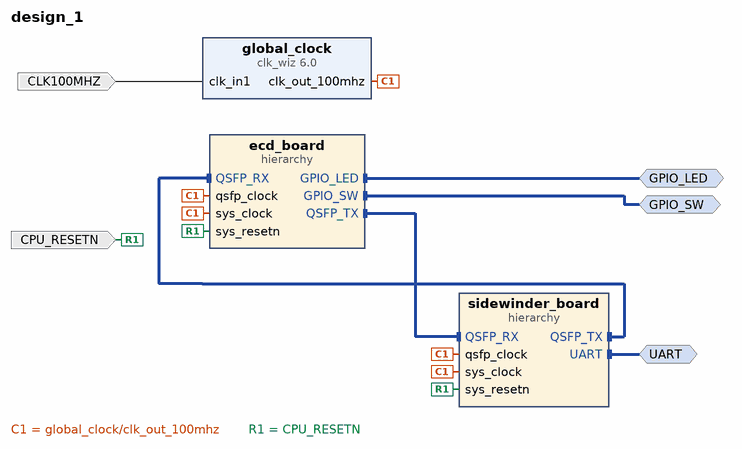
[diagram p0: block diagram of the top level]
# Vivado block design design_1, xc7a100tcsg324-1, Vivado 2021.1
create_bd_design design_1

create_bd_intf_port -mode Master -vlnv xilinx.com:interface:uart_rtl:1.0 UART
create_bd_intf_port -mode Master -vlnv xilinx.com:interface:gpio_rtl:1.0 GPIO_LED
create_bd_intf_port -mode Master -vlnv xilinx.com:interface:gpio_rtl:1.0 GPIO_SW
create_bd_port -dir I -type rst CPU_RESETN
create_bd_port -dir I -type clk CLK100MHZ
set_property -dict {CONFIG.ASSOCIATED_RESET CPU_RESETN} [get_bd_ports CLK100MHZ]

create_bd_cell -type hier sidewinder_board
create_bd_cell -type ip -vlnv xilinx.com:ip:clk_wiz:6.0 global_clock
set_property -dict [list \
  CONFIG.CLKOUT1_DRIVES BUFGCE \
  CONFIG.CLKOUT2_DRIVES BUFGCE \
  CONFIG.CLKOUT3_DRIVES BUFGCE \
  CONFIG.CLKOUT4_DRIVES BUFGCE \
  CONFIG.CLKOUT5_DRIVES BUFGCE \
  CONFIG.CLKOUT6_DRIVES BUFGCE \
  CONFIG.CLKOUT7_DRIVES BUFGCE \
  CONFIG.CLK_OUT1_PORT clk_out_100mhz \
  CONFIG.FEEDBACK_SOURCE FDBK_AUTO \
  CONFIG.USE_LOCKED false \
  CONFIG.USE_RESET false \
  CONFIG.USE_SAFE_CLOCK_STARTUP true \
] [get_bd_cells global_clock]
create_bd_cell -type hier ecd_board

# ---- hierarchy /sidewinder_board ----
current_bd_instance /sidewinder_board
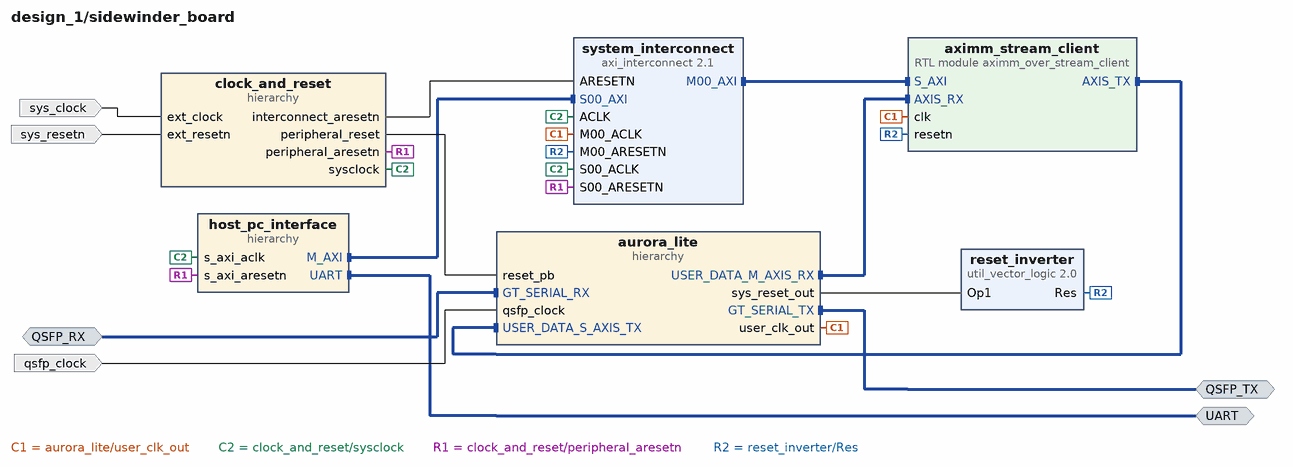
[diagram p1: block diagram inside /sidewinder_board]
create_bd_intf_pin -mode Master -vlnv xilinx.com:interface:uart_rtl:1.0 UART
create_bd_intf_pin -mode Slave -vlnv xilinx.com:interface:axis_rtl:1.0 QSFP_RX
create_bd_intf_pin -mode Master -vlnv xilinx.com:interface:axis_rtl:1.0 QSFP_TX
create_bd_pin -dir I -type rst sys_resetn
create_bd_pin -dir I -type clk sys_clock
create_bd_pin -dir I -type clk qsfp_clock

create_bd_cell -type hier clock_and_reset
create_bd_cell -type hier host_pc_interface
create_bd_cell -type hier aurora_lite
create_bd_cell -type ip -vlnv xilinx.com:ip:axi_interconnect:2.1 system_interconnect
set_property -dict {CONFIG.NUM_MI 1} [get_bd_cells system_interconnect]
create_bd_cell -type ip -vlnv xilinx.com:ip:util_vector_logic:2.0 reset_inverter
set_property -dict {CONFIG.C_OPERATION not CONFIG.C_SIZE 1} [get_bd_cells reset_inverter]
create_bd_cell -type module -reference aximm_over_stream_client aximm_stream_client

# ---- hierarchy /sidewinder_board/clock_and_reset ----
current_bd_instance /sidewinder_board/clock_and_reset
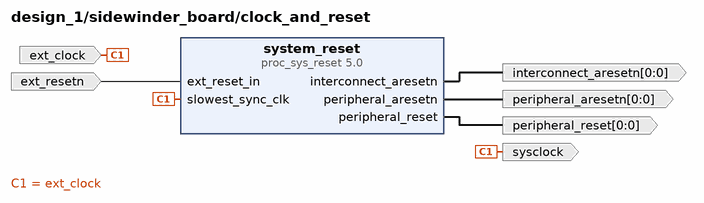
[diagram p2: block diagram inside /sidewinder_board/clock_and_reset]
create_bd_pin -dir I -type clk ext_clock
create_bd_pin -dir O -type clk sysclock
create_bd_pin -dir O -from 0 -to 0 -type rst interconnect_aresetn
create_bd_pin -dir I -type rst ext_resetn
create_bd_pin -dir O -from 0 -to 0 -type rst peripheral_aresetn
create_bd_pin -dir O -from 0 -to 0 -type rst peripheral_reset

create_bd_cell -type ip -vlnv xilinx.com:ip:proc_sys_reset:5.0 system_reset

# ---- hierarchy /sidewinder_board/host_pc_interface ----
current_bd_instance /sidewinder_board/host_pc_interface
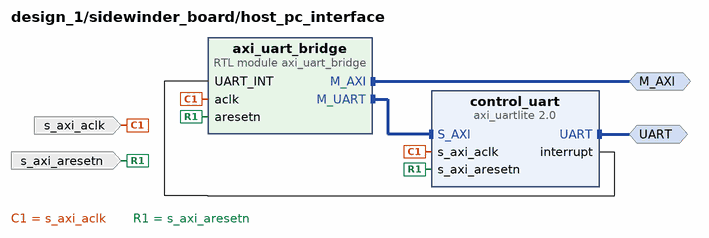
[diagram p3: block diagram inside /sidewinder_board/host_pc_interface]
create_bd_intf_pin -mode Master -vlnv xilinx.com:interface:uart_rtl:1.0 UART
create_bd_intf_pin -mode Master -vlnv xilinx.com:interface:aximm_rtl:1.0 M_AXI
create_bd_pin -dir I -type clk s_axi_aclk
create_bd_pin -dir I -type rst s_axi_aresetn

create_bd_cell -type ip -vlnv xilinx.com:ip:axi_uartlite:2.0 control_uart
set_property -dict {CONFIG.C_BAUDRATE 115200} [get_bd_cells control_uart]
create_bd_cell -type module -reference axi_uart_bridge axi_uart_bridge

# ---- hierarchy /sidewinder_board/aurora_lite ----
current_bd_instance /sidewinder_board/aurora_lite
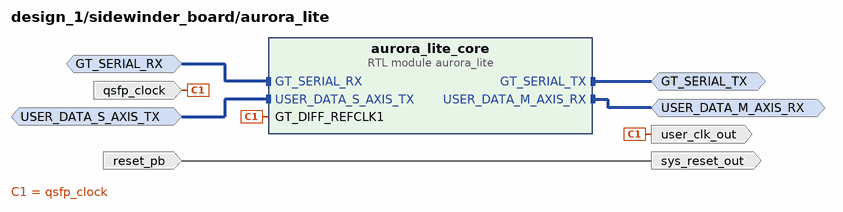
[diagram p4: block diagram inside /sidewinder_board/aurora_lite]
create_bd_intf_pin -mode Slave -vlnv xilinx.com:interface:axis_rtl:1.0 GT_SERIAL_RX
create_bd_intf_pin -mode Master -vlnv xilinx.com:interface:axis_rtl:1.0 GT_SERIAL_TX
create_bd_intf_pin -mode Master -vlnv xilinx.com:interface:axis_rtl:1.0 USER_DATA_M_AXIS_RX
create_bd_intf_pin -mode Slave -vlnv xilinx.com:interface:axis_rtl:1.0 USER_DATA_S_AXIS_TX
create_bd_pin -dir I -type clk qsfp_clock
create_bd_pin -dir I reset_pb
create_bd_pin -dir O sys_reset_out
create_bd_pin -dir O user_clk_out

create_bd_cell -type module -reference aurora_lite aurora_lite_core

# ---- hierarchy /ecd_board ----
current_bd_instance /ecd_board
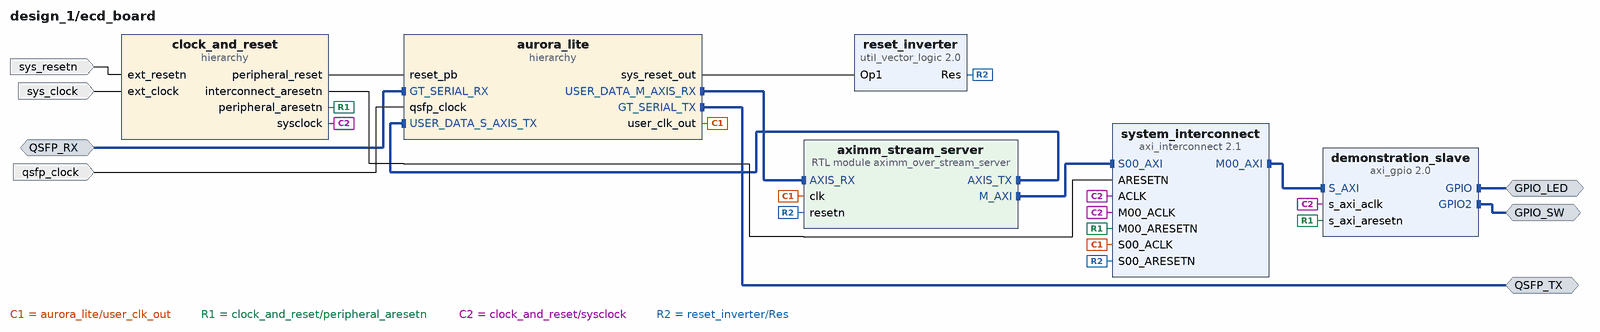
[diagram p5: block diagram inside /ecd_board]
create_bd_intf_pin -mode Master -vlnv xilinx.com:interface:axis_rtl:1.0 QSFP_TX
create_bd_intf_pin -mode Slave -vlnv xilinx.com:interface:axis_rtl:1.0 QSFP_RX
create_bd_intf_pin -mode Master -vlnv xilinx.com:interface:gpio_rtl:1.0 GPIO_LED
create_bd_intf_pin -mode Master -vlnv xilinx.com:interface:gpio_rtl:1.0 GPIO_SW
create_bd_pin -dir I -type clk sys_clock
create_bd_pin -dir I -type rst sys_resetn
create_bd_pin -dir I qsfp_clock

create_bd_cell -type hier clock_and_reset
create_bd_cell -type ip -vlnv xilinx.com:ip:axi_gpio:2.0 demonstration_slave
set_property -dict [list \
  CONFIG.C_ALL_INPUTS_2 1 \
  CONFIG.C_ALL_OUTPUTS 1 \
  CONFIG.C_GPIO2_WIDTH 16 \
  CONFIG.C_GPIO_WIDTH 16 \
  CONFIG.C_IS_DUAL 1 \
] [get_bd_cells demonstration_slave]
create_bd_cell -type ip -vlnv xilinx.com:ip:axi_interconnect:2.1 system_interconnect
set_property -dict {CONFIG.NUM_MI 1} [get_bd_cells system_interconnect]
create_bd_cell -type ip -vlnv xilinx.com:ip:util_vector_logic:2.0 reset_inverter
set_property -dict {CONFIG.C_OPERATION not CONFIG.C_SIZE 1} [get_bd_cells reset_inverter]
create_bd_cell -type hier aurora_lite
create_bd_cell -type module -reference aximm_over_stream_server aximm_stream_server

# ---- hierarchy /ecd_board/clock_and_reset ----
current_bd_instance /ecd_board/clock_and_reset
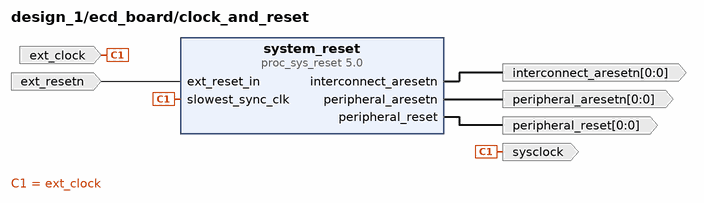
[diagram p6: block diagram inside /ecd_board/clock_and_reset]
create_bd_pin -dir I -type clk ext_clock
create_bd_pin -dir I -type rst ext_resetn
create_bd_pin -dir O -from 0 -to 0 -type rst peripheral_aresetn
create_bd_pin -dir O sysclock
create_bd_pin -dir O -from 0 -to 0 -type rst interconnect_aresetn
create_bd_pin -dir O -from 0 -to 0 -type rst peripheral_reset

create_bd_cell -type ip -vlnv xilinx.com:ip:proc_sys_reset:5.0 system_reset

# ---- hierarchy /ecd_board/aurora_lite ----
current_bd_instance /ecd_board/aurora_lite
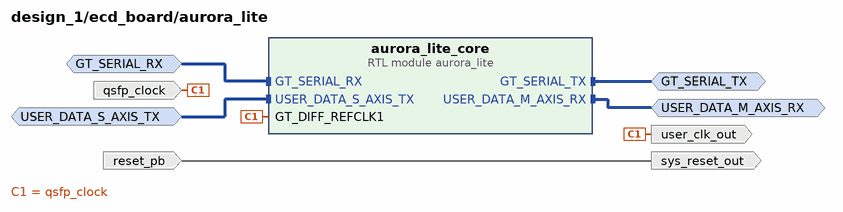
[diagram p7: block diagram inside /ecd_board/aurora_lite]
create_bd_intf_pin -mode Slave -vlnv xilinx.com:interface:axis_rtl:1.0 GT_SERIAL_RX
create_bd_intf_pin -mode Master -vlnv xilinx.com:interface:axis_rtl:1.0 GT_SERIAL_TX
create_bd_intf_pin -mode Master -vlnv xilinx.com:interface:axis_rtl:1.0 USER_DATA_M_AXIS_RX
create_bd_intf_pin -mode Slave -vlnv xilinx.com:interface:axis_rtl:1.0 USER_DATA_S_AXIS_TX
create_bd_pin -dir I qsfp_clock
create_bd_pin -dir O -type clk user_clk_out
create_bd_pin -dir I -type rst reset_pb
create_bd_pin -dir O sys_reset_out

create_bd_cell -type module -reference aurora_lite aurora_lite_core

# ---- connections ----

current_bd_instance /sidewinder_board
connect_bd_intf_net [get_bd_intf_pins QSFP_RX] [get_bd_intf_pins aurora_lite/GT_SERIAL_RX]
connect_bd_intf_net [get_bd_intf_pins aurora_lite/USER_DATA_S_AXIS_TX] [get_bd_intf_pins aximm_stream_client/AXIS_TX]
connect_bd_intf_net [get_bd_intf_pins QSFP_TX] [get_bd_intf_pins aurora_lite/GT_SERIAL_TX]
connect_bd_intf_net [get_bd_intf_pins aurora_lite/USER_DATA_M_AXIS_RX] [get_bd_intf_pins aximm_stream_client/AXIS_RX]
connect_bd_intf_net [get_bd_intf_pins UART] [get_bd_intf_pins host_pc_interface/UART]
connect_bd_intf_net [get_bd_intf_pins host_pc_interface/M_AXI] [get_bd_intf_pins system_interconnect/S00_AXI]
connect_bd_intf_net [get_bd_intf_pins system_interconnect/M00_AXI] [get_bd_intf_pins aximm_stream_client/S_AXI]
connect_bd_net -net CLK100MHZ_1 [get_bd_pins sys_clock] [get_bd_pins clock_and_reset/ext_clock]
connect_bd_net -net CPU_RESETN_1 [get_bd_pins sys_resetn] [get_bd_pins clock_and_reset/ext_resetn]
connect_bd_net -net GT_DIFF_REFCLK1_0_1 [get_bd_pins qsfp_clock] [get_bd_pins aurora_lite/qsfp_clock]
connect_bd_net [get_bd_pins aurora_lite/sys_reset_out] [get_bd_pins reset_inverter/Op1]
connect_bd_net [get_bd_pins aurora_lite/user_clk_out] [get_bd_pins system_interconnect/M00_ACLK] [get_bd_pins aximm_stream_client/clk]
connect_bd_net -net clock_and_reset_clk_100mhz [get_bd_pins clock_and_reset/sysclock] \
  [get_bd_pins host_pc_interface/s_axi_aclk] [get_bd_pins system_interconnect/ACLK] \
  [get_bd_pins system_interconnect/S00_ACLK]
connect_bd_net [get_bd_pins clock_and_reset/interconnect_aresetn] [get_bd_pins system_interconnect/ARESETN]
connect_bd_net [get_bd_pins clock_and_reset/peripheral_aresetn] \
  [get_bd_pins host_pc_interface/s_axi_aresetn] [get_bd_pins system_interconnect/S00_ARESETN]
connect_bd_net [get_bd_pins clock_and_reset/peripheral_reset] [get_bd_pins aurora_lite/reset_pb]
connect_bd_net [get_bd_pins reset_inverter/Res] [get_bd_pins system_interconnect/M00_ARESETN] [get_bd_pins aximm_stream_client/resetn]

current_bd_instance /sidewinder_board/clock_and_reset
connect_bd_net -net CPU_RESETN_1 [get_bd_pins ext_resetn] [get_bd_pins system_reset/ext_reset_in]
connect_bd_net -net system_clock_clk_100mhz [get_bd_pins ext_clock] [get_bd_pins sysclock] [get_bd_pins system_reset/slowest_sync_clk]
connect_bd_net [get_bd_pins system_reset/interconnect_aresetn] [get_bd_pins interconnect_aresetn]
connect_bd_net [get_bd_pins system_reset/peripheral_aresetn] [get_bd_pins peripheral_aresetn]
connect_bd_net [get_bd_pins system_reset/peripheral_reset] [get_bd_pins peripheral_reset]

current_bd_instance /sidewinder_board/host_pc_interface
connect_bd_intf_net [get_bd_intf_pins M_AXI] [get_bd_intf_pins axi_uart_bridge/M_AXI]
connect_bd_intf_net [get_bd_intf_pins UART] [get_bd_intf_pins control_uart/UART]
connect_bd_intf_net [get_bd_intf_pins control_uart/S_AXI] [get_bd_intf_pins axi_uart_bridge/M_UART]
connect_bd_net [get_bd_pins control_uart/interrupt] [get_bd_pins axi_uart_bridge/UART_INT]
connect_bd_net [get_bd_pins s_axi_aclk] [get_bd_pins control_uart/s_axi_aclk] [get_bd_pins axi_uart_bridge/aclk]
connect_bd_net [get_bd_pins s_axi_aresetn] [get_bd_pins control_uart/s_axi_aresetn] [get_bd_pins axi_uart_bridge/aresetn]

current_bd_instance /sidewinder_board/aurora_lite
connect_bd_intf_net [get_bd_intf_pins USER_DATA_M_AXIS_RX] [get_bd_intf_pins aurora_lite_core/USER_DATA_M_AXIS_RX]
connect_bd_intf_net [get_bd_intf_pins GT_SERIAL_RX] [get_bd_intf_pins aurora_lite_core/GT_SERIAL_RX]
connect_bd_intf_net [get_bd_intf_pins GT_SERIAL_TX] [get_bd_intf_pins aurora_lite_core/GT_SERIAL_TX]
connect_bd_intf_net [get_bd_intf_pins USER_DATA_S_AXIS_TX] [get_bd_intf_pins aurora_lite_core/USER_DATA_S_AXIS_TX]
connect_bd_net -net GT_DIFF_REFCLK1_0_1 [get_bd_pins qsfp_clock] [get_bd_pins aurora_lite_core/GT_DIFF_REFCLK1] [get_bd_pins user_clk_out]
connect_bd_net [get_bd_pins reset_pb] [get_bd_pins sys_reset_out]

current_bd_instance /ecd_board
connect_bd_intf_net [get_bd_intf_pins GPIO_LED] [get_bd_intf_pins demonstration_slave/GPIO]
connect_bd_intf_net [get_bd_intf_pins GPIO_SW] [get_bd_intf_pins demonstration_slave/GPIO2]
connect_bd_intf_net [get_bd_intf_pins QSFP_RX] [get_bd_intf_pins aurora_lite/GT_SERIAL_RX]
connect_bd_intf_net [get_bd_intf_pins system_interconnect/S00_AXI] [get_bd_intf_pins aximm_stream_server/M_AXI]
connect_bd_intf_net [get_bd_intf_pins aurora_lite/USER_DATA_S_AXIS_TX] [get_bd_intf_pins aximm_stream_server/AXIS_TX]
connect_bd_intf_net [get_bd_intf_pins QSFP_TX] [get_bd_intf_pins aurora_lite/GT_SERIAL_TX]
connect_bd_intf_net [get_bd_intf_pins aurora_lite/USER_DATA_M_AXIS_RX] [get_bd_intf_pins aximm_stream_server/AXIS_RX]
connect_bd_intf_net [get_bd_intf_pins system_interconnect/M00_AXI] [get_bd_intf_pins demonstration_slave/S_AXI]
connect_bd_net -net ARESETN_1 [get_bd_pins clock_and_reset/interconnect_aresetn] [get_bd_pins system_interconnect/ARESETN]
connect_bd_net [get_bd_pins aurora_lite/sys_reset_out] [get_bd_pins reset_inverter/Op1]
connect_bd_net [get_bd_pins aurora_lite/user_clk_out] [get_bd_pins system_interconnect/S00_ACLK] [get_bd_pins aximm_stream_server/clk]
connect_bd_net [get_bd_pins clock_and_reset/peripheral_aresetn] \
  [get_bd_pins demonstration_slave/s_axi_aresetn] [get_bd_pins system_interconnect/M00_ARESETN]
connect_bd_net [get_bd_pins clock_and_reset/peripheral_reset] [get_bd_pins aurora_lite/reset_pb]
connect_bd_net [get_bd_pins clock_and_reset/sysclock] \
  [get_bd_pins demonstration_slave/s_axi_aclk] [get_bd_pins system_interconnect/M00_ACLK] \
  [get_bd_pins system_interconnect/ACLK]
connect_bd_net -net ext_reset_in_0_1 [get_bd_pins sys_resetn] [get_bd_pins clock_and_reset/ext_resetn]
connect_bd_net [get_bd_pins qsfp_clock] [get_bd_pins aurora_lite/qsfp_clock]
connect_bd_net [get_bd_pins reset_inverter/Res] [get_bd_pins system_interconnect/S00_ARESETN] [get_bd_pins aximm_stream_server/resetn]
connect_bd_net -net slowest_sync_clk_0_1 [get_bd_pins sys_clock] [get_bd_pins clock_and_reset/ext_clock]

current_bd_instance /ecd_board/clock_and_reset
connect_bd_net -net ext_reset_in_0_1 [get_bd_pins ext_resetn] [get_bd_pins system_reset/ext_reset_in]
connect_bd_net -net slowest_sync_clk_0_1 [get_bd_pins ext_clock] [get_bd_pins system_reset/slowest_sync_clk] [get_bd_pins sysclock]
connect_bd_net [get_bd_pins system_reset/interconnect_aresetn] [get_bd_pins interconnect_aresetn]
connect_bd_net [get_bd_pins system_reset/peripheral_aresetn] [get_bd_pins peripheral_aresetn]
connect_bd_net [get_bd_pins system_reset/peripheral_reset] [get_bd_pins peripheral_reset]

current_bd_instance /ecd_board/aurora_lite
connect_bd_intf_net [get_bd_intf_pins USER_DATA_M_AXIS_RX] [get_bd_intf_pins aurora_lite_core/USER_DATA_M_AXIS_RX]
connect_bd_intf_net [get_bd_intf_pins GT_SERIAL_RX] [get_bd_intf_pins aurora_lite_core/GT_SERIAL_RX]
connect_bd_intf_net [get_bd_intf_pins GT_SERIAL_TX] [get_bd_intf_pins aurora_lite_core/GT_SERIAL_TX]
connect_bd_intf_net [get_bd_intf_pins USER_DATA_S_AXIS_TX] [get_bd_intf_pins aurora_lite_core/USER_DATA_S_AXIS_TX]
connect_bd_net -net clock_and_reset_peripheral_reset [get_bd_pins reset_pb] [get_bd_pins sys_reset_out]
connect_bd_net [get_bd_pins qsfp_clock] [get_bd_pins aurora_lite_core/GT_DIFF_REFCLK1] [get_bd_pins user_clk_out]

current_bd_instance /
connect_bd_intf_net [get_bd_intf_pins sidewinder_board/QSFP_RX] [get_bd_intf_pins ecd_board/QSFP_TX]
connect_bd_intf_net [get_bd_intf_ports GPIO_SW] [get_bd_intf_pins ecd_board/GPIO_SW]
connect_bd_intf_net [get_bd_intf_ports GPIO_LED] [get_bd_intf_pins ecd_board/GPIO_LED]
connect_bd_intf_net [get_bd_intf_pins sidewinder_board/QSFP_TX] [get_bd_intf_pins ecd_board/QSFP_RX]
connect_bd_intf_net [get_bd_intf_ports UART] [get_bd_intf_pins sidewinder_board/UART]
connect_bd_net -net CLK100MHZ_1 [get_bd_pins global_clock/clk_out_100mhz] \
  [get_bd_pins sidewinder_board/sys_clock] [get_bd_pins ecd_board/sys_clock] [get_bd_pins sidewinder_board/qsfp_clock] \
  [get_bd_pins ecd_board/qsfp_clock]
connect_bd_net [get_bd_ports CLK100MHZ] [get_bd_pins global_clock/clk_in1]
connect_bd_net [get_bd_ports CPU_RESETN] [get_bd_pins sidewinder_board/sys_resetn] [get_bd_pins ecd_board/sys_resetn]

# ---- address map ----
assign_bd_address -offset 0x0000000000004000 -range 4K -target_address_space [get_bd_addr_spaces ecd_board/aximm_stream_server/M_AXI] [get_bd_addr_segs ecd_board/demonstration_slave/S_AXI/Reg]
assign_bd_address -offset 0x0000000000001000 -range 4K -target_address_space [get_bd_addr_spaces sidewinder_board/host_pc_interface/axi_uart_bridge/M_AXI] [get_bd_addr_segs sidewinder_board/aximm_stream_client/S_AXI/reg0]
assign_bd_address -offset 0x00000000 -range 4K -target_address_space [get_bd_addr_spaces sidewinder_board/host_pc_interface/axi_uart_bridge/M_UART] [get_bd_addr_segs sidewinder_board/host_pc_interface/control_uart/S_AXI/Reg]

set_property USER_COMMENTS.comment_13 {This 'aurora_lite' simulates a XIlinx Aurora IP
core.   It contains the same basic signals that
an Aurora does, and with the same names.

In a real Aurora, the GT_SERIAL_<RX|TX> lines
are multi-gigabit tranceivers.   Here, they are
AXI streams. } [get_bd_cells /ecd_board/aurora_lite]
set_property USER_COMMENTS.comment_0 {This 'aurora_lite' simulates a XIlinx Aurora IP
core.   It contains the same basic signals that
an Aurora does, and with the same names.

In a real Aurora, the GT_SERIAL_<RX|TX> lines
are multi-gigabit tranceivers.   Here, they are
AXI streams. } [get_bd_cells /ecd_board/aurora_lite]
set_property USER_COMMENTS.comment_15 {This 'aurora_lite' simulates a XIlinx Aurora IP
core.   It contains the same basic signals that
an Aurora does, and with the same names.

In a real Aurora, the GT_SERIAL_<RX|TX> lines
are multi-gigabit tranceivers.   Here, they are
AXI streams. } [get_bd_cells /ecd_board/aurora_lite]
set_property USER_COMMENTS.comment_17 {This 'aurora_lite' simulates a XIlinx Aurora IP
core.   It contains the same basic signals that
an Aurora does, and with the same names.

In a real Aurora, the GT_SERIAL_<RX|TX> lines
are multi-gigabit tranceivers.   Here, they are
AXI streams. } [get_bd_cells /ecd_board/aurora_lite]
set_property USER_COMMENTS.comment_20 {This 'aurora_lite' simulates a XIlinx Aurora IP
core.   It contains the same basic signals that
an Aurora does, and with the same names.

In a real Aurora, the GT_SERIAL_<RX|TX> lines
are multi-gigabit tranceivers.   Here, they are
AXI streams. } [get_bd_cells /ecd_board/aurora_lite]
set_property USER_COMMENTS.comment_22 {This 'aurora_lite' simulates a XIlinx Aurora IP
core.   It contains the same basic signals that
an Aurora does, and with the same names.

In a real Aurora, the GT_SERIAL_<RX|TX> lines
are multi-gigabit tranceivers.   Here, they are
AXI streams. } [get_bd_cells /ecd_board/aurora_lite]
set_property USER_COMMENTS.comment_26 {This 'aurora_lite' simulates a XIlinx Aurora IP
core.   It contains the same basic signals that
an Aurora does, and with the same names.

In a real Aurora, the GT_SERIAL_<RX|TX> lines
are multi-gigabit tranceivers.   Here, they are
AXI streams. } [get_bd_cells /ecd_board/aurora_lite]
set_property USER_COMMENTS.comment_27 {This 'aurora_lite' simulates a XIlinx Aurora IP
core.   It contains the same basic signals that
an Aurora does, and with the same names.

In a real Aurora, the GT_SERIAL_<RX|TX> lines
are multi-gigabit tranceivers.   Here, they are
AXI streams. } [get_bd_cells /ecd_board/aurora_lite]
set_property USER_COMMENTS.comment_29 {This 'aurora_lite' simulates a XIlinx Aurora IP
core.   It contains the same basic signals that
an Aurora does, and with the same names.

In a real Aurora, the GT_SERIAL_<RX|TX> lines
are multi-gigabit tranceivers.   Here, they are
AXI streams. } [get_bd_cells /ecd_board/aurora_lite]
set_property USER_COMMENTS.comment_31 {This 'aurora_lite' simulates a XIlinx Aurora IP
core.   It contains the same basic signals that
an Aurora does, and with the same names.

In a real Aurora, the GT_SERIAL_<RX|TX> lines
are multi-gigabit tranceivers.   Here, they are
AXI streams. } [get_bd_cells /ecd_board/aurora_lite]
set_property USER_COMMENTS.comment_34 {This 'aurora_lite' simulates a XIlinx Aurora IP
core.   It contains the same basic signals that
an Aurora does, and with the same names.

In a real Aurora, the GT_SERIAL_<RX|TX> lines
are multi-gigabit tranceivers.   Here, they are
AXI streams. } [get_bd_cells /ecd_board/aurora_lite]
set_property USER_COMMENTS.comment_38 {This 'aurora_lite' simulates a XIlinx Aurora IP
core.   It contains the same basic signals that
an Aurora does, and with the same names.

In a real Aurora, the GT_SERIAL_<RX|TX> lines
are multi-gigabit tranceivers.   Here, they are
AXI streams. } [get_bd_cells /ecd_board/aurora_lite]
set_property USER_COMMENTS.comment_41 {This 'aurora_lite' simulates a XIlinx Aurora IP
core.   It contains the same basic signals that
an Aurora does, and with the same names.

In a real Aurora, the GT_SERIAL_<RX|TX> lines
are multi-gigabit tranceivers.   Here, they are
AXI streams. } [get_bd_cells /ecd_board/aurora_lite]
set_property USER_COMMENTS.comment_44 {This 'aurora_lite' simulates a XIlinx Aurora IP
core.   It contains the same basic signals that
an Aurora does, and with the same names.

In a real Aurora, the GT_SERIAL_<RX|TX> lines
are multi-gigabit tranceivers.   Here, they are
AXI streams. } [get_bd_cells /ecd_board/aurora_lite]
set_property USER_COMMENTS.comment_48 {This 'aurora_lite' simulates a XIlinx Aurora IP
core.   It contains the same basic signals that
an Aurora does, and with the same names.

In a real Aurora, the GT_SERIAL_<RX|TX> lines
are multi-gigabit tranceivers.   Here, they are
AXI streams. } [get_bd_cells /ecd_board/aurora_lite]
set_property USER_COMMENTS.comment_54 {This 'aurora_lite' simulates a XIlinx Aurora IP
core.   It contains the same basic signals that
an Aurora does, and with the same names.

In a real Aurora, the GT_SERIAL_<RX|TX> lines
are multi-gigabit tranceivers.   Here, they are
AXI streams. } [get_bd_cells /ecd_board/aurora_lite]
set_property USER_COMMENTS.comment_2 {When the 'aximm_stream_client' on the 
other board is the target of AXI read/
write transactions, those AXI transactions
are actually carried out here, by the 
'aximm_stream_server'} [get_bd_cells /ecd_board/aximm_stream_server]
set_property USER_COMMENTS.comment_28 {In this demonstration, the
'demonstration_slave' serves
as the target for AXI read/write
transactions originating from
the other system} [get_bd_cells /ecd_board/demonstration_slave]
set_property USER_COMMENTS.comment_30 {In this demonstration, the
'demonstration_slave' serves
as the target for AXI read/write
transactions originating from
the other system} [get_bd_cells /ecd_board/demonstration_slave]
set_property USER_COMMENTS.comment_32 {In this demonstration, the
'demonstration_slave' serves
as the target for AXI read/write
transactions originating from
the other system} [get_bd_cells /ecd_board/demonstration_slave]
set_property USER_COMMENTS.comment_1 {In this demonstration, the
'demonstration_slave' serves
as the target for AXI read/write
transactions originating from
the other system} [get_bd_cells /ecd_board/demonstration_slave]
set_property USER_COMMENTS.comment_35 {In this demonstration, the
'demonstration_slave' serves
as the target for AXI read/write
transactions originating from
the other system} [get_bd_cells /ecd_board/demonstration_slave]
set_property USER_COMMENTS.comment_39 {In this demonstration, the
'demonstration_slave' serves
as the target for AXI read/write
transactions originating from
the other system} [get_bd_cells /ecd_board/demonstration_slave]
set_property USER_COMMENTS.comment_42 {In this demonstration, the
'demonstration_slave' serves
as the target for AXI read/write
transactions originating from
the other system} [get_bd_cells /ecd_board/demonstration_slave]
set_property USER_COMMENTS.comment_45 {In this demonstration, the
'demonstration_slave' serves
as the target for AXI read/write
transactions originating from
the other system} [get_bd_cells /ecd_board/demonstration_slave]
set_property USER_COMMENTS.comment_49 {In this demonstration, the
'demonstration_slave' serves
as the target for AXI read/write
transactions originating from
the other system} [get_bd_cells /ecd_board/demonstration_slave]
set_property USER_COMMENTS.comment_55 {In this demonstration, the
'demonstration_slave' serves
as the target for AXI read/write
transactions originating from
the other system} [get_bd_cells /ecd_board/demonstration_slave]
set_property USER_COMMENTS.comment_37 {In this example design we have a Sidewinder board and an ECD board represented
by two wholly independent heirarchies, connected only by QSFP lines.

In a design using real QSFP28 hardware, the QSFP_<RX|TX> lines are a physical
cable.   In this example design, they are a pair of AXI Stream interfaces.

In this demonstration, the clock and reset lines of both boards are supplied from a
common set of signals.  In a real design, clock and reset would of course come
from the appropriate pins on the individual boards
} [get_bd_cells /global_clock]
set_property USER_COMMENTS.comment_24 {The 'aximm_stream_client' is an 
AXI4-Lite slave device.  AXI read
and write transactions to its 
registers are seamlessly carried
out on the remote system} [get_bd_cells /sidewinder_board]
set_property USER_COMMENTS.comment_0 {This 'aurora_lite' simulates a XIlinx Aurora IP
core.   It contains the same basic signals that
an Aurora does, and with the same names.

In a real Aurora, the GT_SERIAL_<RX|TX> lines
are multi-gigabit tranceivers.   Here, they are
AXI streams. } [get_bd_cells /sidewinder_board/aurora_lite]
set_property USER_COMMENTS.comment_12 {Enter Comments here} [get_bd_cells /sidewinder_board/aurora_lite]
set_property USER_COMMENTS.comment_51 {This 'aurora_lite' simulates a XIlinx Aurora IP
core.   It contains the same basic signals that
an Aurora does, and with the same names.

In a real Aurora, the GT_SERIAL_<RX|TX> lines
are multi-gigabit tranceivers.   Here, they are
AXI streams. } [get_bd_cells /sidewinder_board/aurora_lite]
set_property USER_COMMENTS.comment_53 {The 'aximm_stream_client' is an 
AXI4-Lite slave device.  AXI read
and write transactions to its 
registers are seamlessly carried
out on the remote system} [get_bd_cells /sidewinder_board/aximm_stream_client]
set_property USER_COMMENTS.comment_14 {In this example design, the host
PC interface into our AXI bus is via
a UART.   In a more complex design
the host PC would interface to our
AXI bus via a PCIe bridge} [get_bd_cells /sidewinder_board/host_pc_interface]
set_property USER_COMMENTS.comment_16 {In this example design, the host PC
interfaces to our AXI bus is via UART.

In a more complex design, the host
PC interface might be via a PCIe
bridge} [get_bd_cells /sidewinder_board/host_pc_interface]
set_property USER_COMMENTS.comment_4 {iface comment} [get_bd_cells /sidewinder_board/host_pc_interface]
set_property USER_COMMENTS.comment_7 {iface comment} [get_bd_cells /sidewinder_board/host_pc_interface]
set_property USER_COMMENTS.comment_52 {In this example design, the host PC
interface to our AXI bus is via UART.

In a more complex design, the host
PC interface might be via a PCIe
bridge} [get_bd_cells /sidewinder_board/host_pc_interface]

validate_bd_design
save_bd_design
